# Altium project COMRAD_0v1.PrjPCB (part 1 of 5)
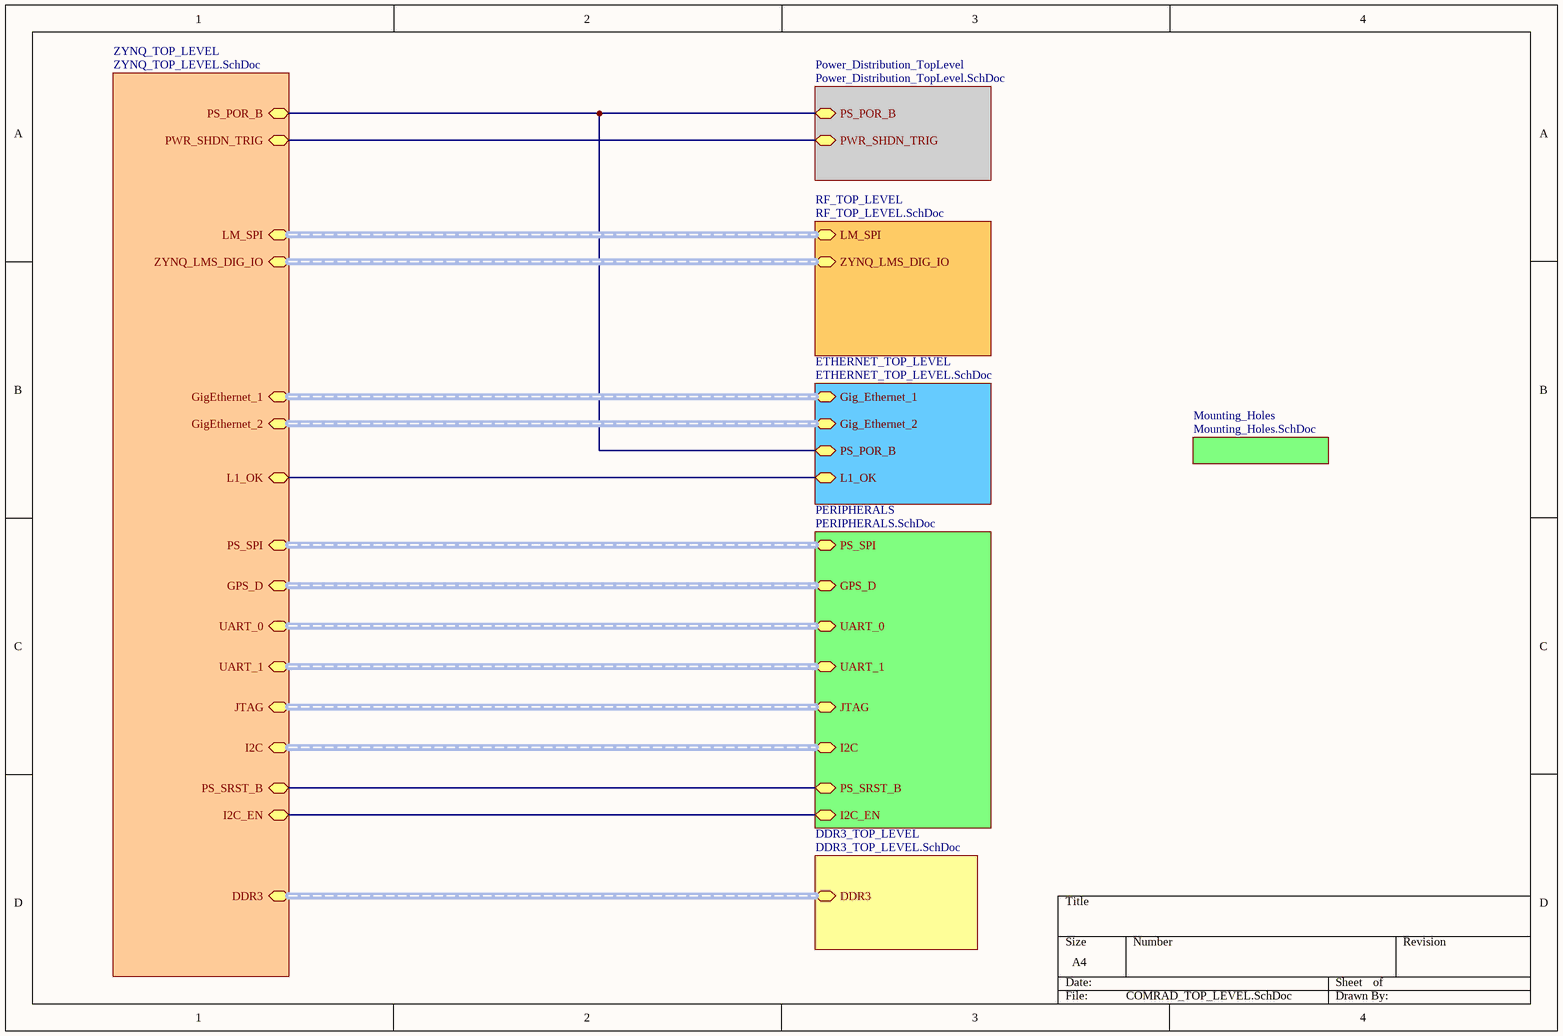
[diagram p0: COMRAD_TOP_LEVEL.SchDoc]
47 sheets, 837 parts. Net scope: hierarchical (ports join the sheet entries above them; power ports are global).
Board file: WhiteRHINO_0v1.PcbDoc
Sheets:
  COMRAD_TOP_LEVEL.SchDoc
    ZYNQ_TOP_LEVEL = ZYNQ_TOP_LEVEL.SchDoc
      ZYNQ_DDR3_Bank_502 = ZYNQ_DDR3_Bank_502.SchDoc
      ZYNQ_MIOBank_500 = ZYNQ_MIOBank_500.SchDoc
      ZYNQ_MIOBank_501 = ZYNQ_MIOBank_501.SchDoc
      ZYNQ_PL_Bank_13 = ZYNQ_PL_Bank_13.SchDoc
      ZYNQ_PL_Bank_33 = ZYNQ_PL_Bank_33.SchDoc
      ZYNQ_PL_Bank_34 = ZYNQ_PL_Bank_34.SchDoc
      ZYNQ_PL_Bank_35 = ZYNQ_PL_Bank_35.SchDoc
      ZYNQ_Power = ZYNQ_Power.SchDoc
      ZYNQ_CONFIG = ZYNQ_CONFIG.SchDoc
    ETHERNET_TOP_LEVEL = ETHERNET_TOP_LEVEL.SchDoc
      Ethernet1 = Ethernet1.SchDoc
      Ethernet1_MDIO = Ethernet1_MDIO.SchDoc
      Ethernet1_Power = Ethernet1_Power.SchDoc
      Ethernet2 = Ethernet2.SchDoc
      Ethernet2_MDIO = Ethernet2_MDIO.SchDoc
      Ethernet2_Power = Ethernet2_Power.SchDoc
    PERIPHERALS = PERIPHERALS.SchDoc
      BootFlash_SPI = BootFlash_SPI.SchDoc
      GPS_Receiver = GPS_Receiver.SchDoc
      USBJTAG_USBUART_4-Channel = USBJTAG_USBUART_4-Channel.SchDoc
      Temperature_Sensors = Temperature_Sensors.SchDoc
    RF_TOP_LEVEL = RF_TOP_LEVEL.SchDoc
      RF_Receive = RF_Receive.SchDoc
      RF_Transmit = RF_Transmit.SchDoc
      RF_Transceiver_LMS6003D_TopLevel = RF_Transceiver_LMS6003D_TopLevel.SchDoc
        RF_Transceiver_LM6002D = RF_Transceiver_LM6002D.SchDoc
        RF_Transceiver_LM6002D_Power = RF_Transceiver_LM6002D_Power.SchDoc
        RF_Transceiver_LMS6002_PLL_CLK = RF_Transceiver_LMS6002_PLL_CLK.SchDoc
    Power_Distribution_TopLevel = Power_Distribution_TopLevel.SchDoc
      PowerSwitch = PowerSwitch.SchDoc
      Power_Regulators_Digital_1 = Power_Regulators_Digital_1.SchDoc
      Power_Regulators_Digital_2 = Power_Regulators_Digital_2.SchDoc
      Power_Regulators_Digital_3 = Power_Regulators_Digital_3.SchDoc
      Power_Regulators_Digital_4 = Power_Regulators_Digital_4.SchDoc
      Power_Regulators_Digital_5 = Power_Regulators_Digital_5.SchDoc
      Power_Regulators_Ether2V5 = Power_Regulators_Ether2V5.SchDoc
      Power_Regulators_RF_2 = Power_Regulators_RF_2.SchDoc
      Power_Regulators_RF_3 = Power_Regulators_RF_3.SchDoc
      Power_Regulators_RF_4 = Power_Regulators_RF_4.SchDoc
      Shundown_Mechanism = Shundown_Mechanism.SchDoc
    DDR3_TOP_LEVEL = DDR3_TOP_LEVEL.SchDoc
      DDR3_1 = DDR3_1.SchDoc
      DDR3_2 = DDR3_2.SchDoc
      DDR3_Power_Termination = DDR3_Power_Termination.SchDoc
    Mounting_Holes = Mounting_Holes.SchDoc

## Sheet COMRAD_TOP_LEVEL.SchDoc
size A4; DocumentNumber: 1; SheetNumber: 1; SheetTotal: 47

### Sub-sheets
DDR3_TOP_LEVEL = DDR3_TOP_LEVEL.SchDoc: DDR3 (harness DDR3)
ETHERNET_TOP_LEVEL = ETHERNET_TOP_LEVEL.SchDoc: Gig_Ethernet_1 (harness Gig_Ethernet1), Gig_Ethernet_2 (harness Gig_Ethernet2), PS_POR_B (bidir), L1_OK
Mounting_Holes = Mounting_Holes.SchDoc: no entries
PERIPHERALS = PERIPHERALS.SchDoc: PS_SPI (harness SPI), GPS_D (harness GPS), UART_0 (harness UART_0), JTAG (harness JTAG), UART_1 (harness UART_1), I2C (harness I2C), PS_SRST_B (bidir), I2C_EN (bidir)
Power_Distribution_TopLevel = Power_Distribution_TopLevel.SchDoc: PS_POR_B (bidir), PWR_SHDN_TRIG (bidir)
RF_TOP_LEVEL = RF_TOP_LEVEL.SchDoc: LM_SPI (harness LM_SPI), ZYNQ_LMS_DIG_IO (harness DIG_IO)
ZYNQ_TOP_LEVEL = ZYNQ_TOP_LEVEL.SchDoc: DDR3 (harness DDR3), PS_SPI (harness SPI), UART_0 (harness UART_0), GigEthernet_1 (harness Gig_Ethernet1), GigEthernet_2 (harness Gig_Ethernet2), JTAG (harness JTAG), ZYNQ_LMS_DIG_IO (harness DIG_IO), LM_SPI (harness LM_SPI), GPS_D (harness GPS), PS_POR_B (bidir), UART_1 (harness UART_1), I2C (harness I2C), PS_SRST_B (bidir), PWR_SHDN_TRIG (bidir), I2C_EN (bidir), L1_OK

### Nets
I2C_EN: sheet ZYNQ_TOP_LEVEL/I2C_EN, sheet PERIPHERALS/I2C_EN
PS_POR_B: sheet ZYNQ_TOP_LEVEL/PS_POR_B, sheet ETHERNET_TOP_LEVEL/PS_POR_B, sheet Power_Distribution_TopLevel/PS_POR_B
PS_SRST_B: sheet ZYNQ_TOP_LEVEL/PS_SRST_B, sheet PERIPHERALS/PS_SRST_B
NetJ11_2: sheet ZYNQ_TOP_LEVEL/L1_OK, sheet ETHERNET_TOP_LEVEL/L1_OK
NetR316_2: sheet ZYNQ_TOP_LEVEL/PWR_SHDN_TRIG, sheet Power_Distribution_TopLevel/PWR_SHDN_TRIG

### Buses and harness runs
harness sheet DDR3_TOP_LEVEL/DDR3 = sheet ZYNQ_TOP_LEVEL/DDR3
harness sheet ETHERNET_TOP_LEVEL/Gig_Ethernet_1 = sheet ZYNQ_TOP_LEVEL/GigEthernet_1
harness sheet ETHERNET_TOP_LEVEL/Gig_Ethernet_2 = sheet ZYNQ_TOP_LEVEL/GigEthernet_2
harness sheet PERIPHERALS/GPS_D = sheet ZYNQ_TOP_LEVEL/GPS_D
harness sheet PERIPHERALS/I2C = sheet ZYNQ_TOP_LEVEL/I2C
harness sheet PERIPHERALS/JTAG = sheet ZYNQ_TOP_LEVEL/JTAG
harness sheet PERIPHERALS/PS_SPI = sheet ZYNQ_TOP_LEVEL/PS_SPI
harness sheet PERIPHERALS/UART_0 = sheet ZYNQ_TOP_LEVEL/UART_0
harness sheet PERIPHERALS/UART_1 = sheet ZYNQ_TOP_LEVEL/UART_1
harness sheet RF_TOP_LEVEL/LM_SPI = sheet ZYNQ_TOP_LEVEL/LM_SPI
harness sheet RF_TOP_LEVEL/ZYNQ_LMS_DIG_IO = sheet ZYNQ_TOP_LEVEL/ZYNQ_LMS_DIG_IO

## Sheet ZYNQ_TOP_LEVEL.SchDoc
size A4; DocumentNumber: 41; SheetNumber: 41; SheetTotal: 47
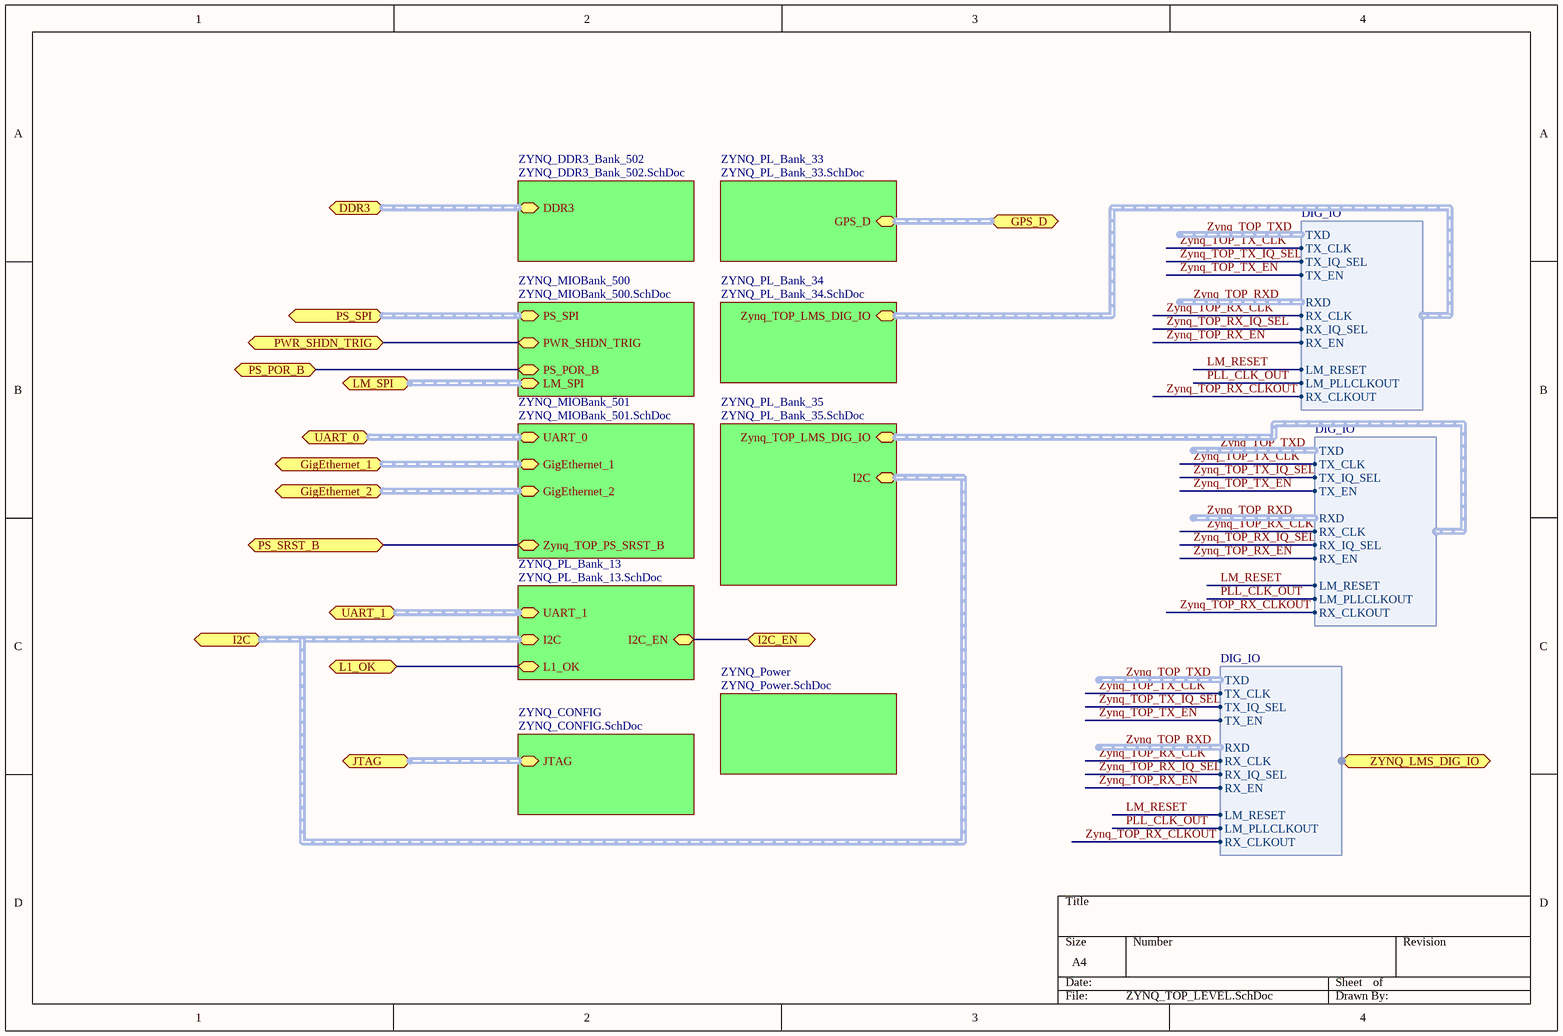
[diagram p1: ZYNQ_TOP_LEVEL.SchDoc]

### Sub-sheets
ZYNQ_CONFIG = ZYNQ_CONFIG.SchDoc: JTAG (harness JTAG)
ZYNQ_DDR3_Bank_502 = ZYNQ_DDR3_Bank_502.SchDoc: DDR3 (harness DDR3)
ZYNQ_MIOBank_500 = ZYNQ_MIOBank_500.SchDoc: PS_SPI (harness SPI), PS_POR_B (bidir), PWR_SHDN_TRIG (bidir), LM_SPI (harness LM_SPI)
ZYNQ_MIOBank_501 = ZYNQ_MIOBank_501.SchDoc: UART_0 (harness UART_0), GigEthernet_1 (harness Gig_Ethernet1), GigEthernet_2 (harness Gig_Ethernet2), Zynq_TOP_PS_SRST_B (bidir)
ZYNQ_PL_Bank_13 = ZYNQ_PL_Bank_13.SchDoc: UART_1 (harness UART_1), I2C (harness I2C), L1_OK, I2C_EN
ZYNQ_PL_Bank_33 = ZYNQ_PL_Bank_33.SchDoc: GPS_D (harness GPS)
ZYNQ_PL_Bank_34 = ZYNQ_PL_Bank_34.SchDoc: Zynq_TOP_LMS_DIG_IO (harness DIG_IO)
ZYNQ_PL_Bank_35 = ZYNQ_PL_Bank_35.SchDoc: Zynq_TOP_LMS_DIG_IO (harness DIG_IO), I2C (harness I2C)
ZYNQ_Power = ZYNQ_Power.SchDoc: no entries

### Ports
DDR3 (harness DDR3), GigEthernet_1 (harness Gig_Ethernet1), GigEthernet_2 (harness Gig_Ethernet2), GPS_D (harness GPS), I2C (harness I2C), I2C_EN (bidir), JTAG (harness JTAG), L1_OK, LM_SPI (harness LM_SPI), PS_POR_B (bidir), PS_SPI (harness SPI), PS_SRST_B (bidir), PWR_SHDN_TRIG (bidir), UART_0 (harness UART_0), UART_1 (harness UART_1), ZYNQ_LMS_DIG_IO (harness DIG_IO)

### Harnesses
DIG_IO: TXD, TX_CLK, TX_IQ_SEL, TX_EN, RXD, RX_CLK, RX_IQ_SEL, RX_EN, LM_RESET, LM_PLLCLKOUT, RX_CLKOUT

### Nets
I2C_EN: port I2C_EN, sheet ZYNQ_PL_Bank_13/I2C_EN
LM_RESET: sheet ZYNQ_PL_Bank_34/Zynq_TOP_LMS_DIG_IO.LM_RESET, sheet ZYNQ_PL_Bank_35/Zynq_TOP_LMS_DIG_IO.LM_RESET, port ZYNQ_LMS_DIG_IO.LM_RESET
PLL_CLK_OUT: sheet ZYNQ_PL_Bank_34/Zynq_TOP_LMS_DIG_IO.LM_PLLCLKOUT, sheet ZYNQ_PL_Bank_35/Zynq_TOP_LMS_DIG_IO.LM_PLLCLKOUT, port ZYNQ_LMS_DIG_IO.LM_PLLCLKOUT
PS_POR_B: port PS_POR_B, sheet ZYNQ_MIOBank_500/PS_POR_B
PS_SRST_B: port PS_SRST_B, sheet ZYNQ_MIOBank_501/Zynq_TOP_PS_SRST_B
Zynq_TOP_RX_CLK: sheet ZYNQ_PL_Bank_34/Zynq_TOP_LMS_DIG_IO.RX_CLK, sheet ZYNQ_PL_Bank_35/Zynq_TOP_LMS_DIG_IO.RX_CLK, port ZYNQ_LMS_DIG_IO.RX_CLK  [project net RX_CLK]
Zynq_TOP_RX_CLKOUT: sheet ZYNQ_PL_Bank_34/Zynq_TOP_LMS_DIG_IO.RX_CLKOUT, sheet ZYNQ_PL_Bank_35/Zynq_TOP_LMS_DIG_IO.RX_CLKOUT, port ZYNQ_LMS_DIG_IO.RX_CLKOUT  [project net RX_CLKOUT]
Zynq_TOP_RX_EN: sheet ZYNQ_PL_Bank_34/Zynq_TOP_LMS_DIG_IO.RX_EN, sheet ZYNQ_PL_Bank_35/Zynq_TOP_LMS_DIG_IO.RX_EN, port ZYNQ_LMS_DIG_IO.RX_EN  [project net RX_EN]
Zynq_TOP_RX_IQ_SEL: sheet ZYNQ_PL_Bank_34/Zynq_TOP_LMS_DIG_IO.RX_IQ_SEL, sheet ZYNQ_PL_Bank_35/Zynq_TOP_LMS_DIG_IO.RX_IQ_SEL, port ZYNQ_LMS_DIG_IO.RX_IQ_SEL  [project net RX_IQ_SEL]
Zynq_TOP_TX_CLK: sheet ZYNQ_PL_Bank_34/Zynq_TOP_LMS_DIG_IO.TX_CLK, sheet ZYNQ_PL_Bank_35/Zynq_TOP_LMS_DIG_IO.TX_CLK, port ZYNQ_LMS_DIG_IO.TX_CLK  [project net TX_CLK]
Zynq_TOP_TX_EN: sheet ZYNQ_PL_Bank_34/Zynq_TOP_LMS_DIG_IO.TX_EN, sheet ZYNQ_PL_Bank_35/Zynq_TOP_LMS_DIG_IO.TX_EN, port ZYNQ_LMS_DIG_IO.TX_EN  [project net TX_EN]
Zynq_TOP_TX_IQ_SEL: sheet ZYNQ_PL_Bank_34/Zynq_TOP_LMS_DIG_IO.TX_IQ_SEL, sheet ZYNQ_PL_Bank_35/Zynq_TOP_LMS_DIG_IO.TX_IQ_SEL, port ZYNQ_LMS_DIG_IO.TX_IQ_SEL  [project net TX_IQ_SEL]
NetJ11_2: port L1_OK, sheet ZYNQ_PL_Bank_13/L1_OK
NetR316_2: port PWR_SHDN_TRIG, sheet ZYNQ_MIOBank_500/PWR_SHDN_TRIG

### Buses and harness runs
harness port DDR3 = sheet ZYNQ_DDR3_Bank_502/DDR3
harness port GigEthernet_1 = sheet ZYNQ_MIOBank_501/GigEthernet_1
harness port GigEthernet_2 = sheet ZYNQ_MIOBank_501/GigEthernet_2
harness port GPS_D = sheet ZYNQ_PL_Bank_33/GPS_D
harness port I2C = sheet ZYNQ_PL_Bank_13/I2C = sheet ZYNQ_PL_Bank_35/I2C
harness port JTAG = sheet ZYNQ_CONFIG/JTAG
harness port LM_SPI = sheet ZYNQ_MIOBank_500/LM_SPI
harness port PS_SPI = sheet ZYNQ_MIOBank_500/PS_SPI
harness port UART_0 = sheet ZYNQ_MIOBank_501/UART_0
harness port UART_1 = sheet ZYNQ_PL_Bank_13/UART_1

## Sheet ZYNQ_DDR3_Bank_502.SchDoc
size A4; DocumentNumber: 10; SheetNumber: 10; SheetTotal: 47
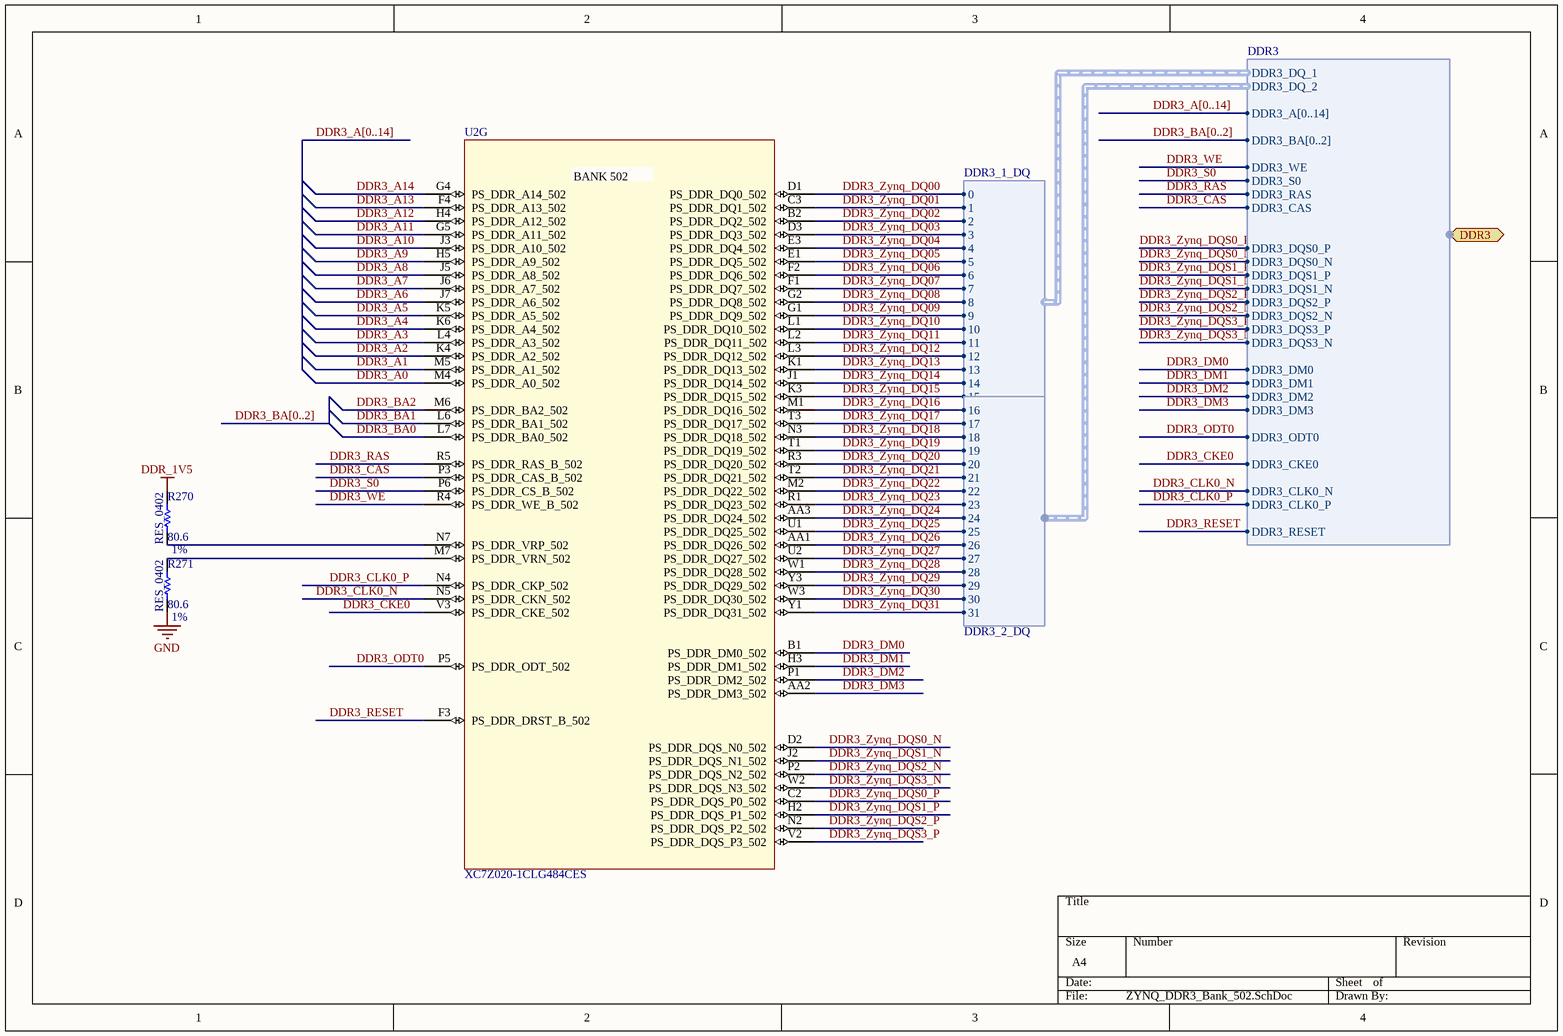
[diagram p2: ZYNQ_DDR3_Bank_502.SchDoc]

### Parts
R270  RES_0402  value 80.6  Tolerance: 1%  [RESC0402(1005)_N]
R271  RES_0402  value 80.6  Tolerance: 1%  [RESC0402(1005)_N]
U2  XC7Z020-1CLG484CES  [ZYNQ_xc7z020clg484pkg_BGA-484]  (part G of 10)

### Ports
DDR3 (harness DDR3)

### Harnesses
DDR3: DDR3_DQ_1, DDR3_DQ_2, DDR3_A[0..14], DDR3_BA[0..2], DDR3_WE, DDR3_S0, DDR3_RAS, DDR3_CAS, DDR3_DQS0_P, DDR3_DQS0_N, DDR3_DQS1_P, DDR3_DQS1_N, DDR3_DQS2_P, DDR3_DQS2_N, DDR3_DQS3_P, DDR3_DQS3_N, DDR3_DM0, DDR3_DM1, DDR3_DM2, DDR3_DM3, DDR3_ODT0, DDR3_CKE0, DDR3_CLK0_N, DDR3_CLK0_P, DDR3_RESET
DDR3_1_DQ: 0, 1, 2, 3, 4, 5, 6, 7, 8, 9, 10, 11, 12, 13, 14, 15
DDR3_2_DQ: 16, 17, 18, 19, 20, 21, 22, 23, 24, 25, 26, 27, 28, 29, 30, 31

### Nets
DDR_1V5: R270.2
GND: R271.1
DDR3_A0: U2.M4(PS_DDR_A0_502)
DDR3_A1: U2.M5(PS_DDR_A1_502)
DDR3_A2: U2.K4(PS_DDR_A2_502)
DDR3_A3: U2.L4(PS_DDR_A3_502)
DDR3_A4: U2.K6(PS_DDR_A4_502)
DDR3_A5: U2.K5(PS_DDR_A5_502)
DDR3_A6: U2.J7(PS_DDR_A6_502)
DDR3_A7: U2.J6(PS_DDR_A7_502)
DDR3_A8: U2.J5(PS_DDR_A8_502)
DDR3_A9: U2.H5(PS_DDR_A9_502)
DDR3_A10: U2.J3(PS_DDR_A10_502)
DDR3_A11: U2.G5(PS_DDR_A11_502)
DDR3_A12: U2.H4(PS_DDR_A12_502)
DDR3_A13: U2.F4(PS_DDR_A13_502)
DDR3_A14: U2.G4(PS_DDR_A14_502)
DDR3_BA0: U2.L7(PS_DDR_BA0_502)
DDR3_BA1: U2.L6(PS_DDR_BA1_502)
DDR3_BA2: U2.M6(PS_DDR_BA2_502)
DDR3_CAS: U2.P3(PS_DDR_CAS_B_502) ; port DDR3.DDR3_CAS
DDR3_CKE0: U2.V3(PS_DDR_CKE_502) ; port DDR3.DDR3_CKE0
DDR3_CLK0_N: U2.N5(PS_DDR_CKN_502) ; port DDR3.DDR3_CLK0_N
DDR3_CLK0_P: U2.N4(PS_DDR_CKP_502) ; port DDR3.DDR3_CLK0_P
DDR3_DM0: U2.B1(PS_DDR_DM0_502) ; port DDR3.DDR3_DM0
DDR3_DM1: U2.H3(PS_DDR_DM1_502) ; port DDR3.DDR3_DM1
DDR3_DM2: U2.P1(PS_DDR_DM2_502) ; port DDR3.DDR3_DM2
DDR3_DM3: U2.AA2(PS_DDR_DM3_502) ; port DDR3.DDR3_DM3
DDR3_ODT0: U2.P5(PS_DDR_ODT_502) ; port DDR3.DDR3_ODT0
DDR3_RAS: U2.R5(PS_DDR_RAS_B_502) ; port DDR3.DDR3_RAS
DDR3_RESET: U2.F3(PS_DDR_DRST_B_502) ; port DDR3.DDR3_RESET
DDR3_S0: U2.P6(PS_DDR_CS_B_502) ; port DDR3.DDR3_S0
DDR3_WE: U2.R4(PS_DDR_WE_B_502) ; port DDR3.DDR3_WE
DDR3_Zynq_DQ00: U2.D1(PS_DDR_DQ0_502) ; harness DDR3_1_DQ.0  [project net DDR3_DQ00]
DDR3_Zynq_DQ01: U2.C3(PS_DDR_DQ1_502) ; harness DDR3_1_DQ.1  [project net DDR3_DQ01]
DDR3_Zynq_DQ02: U2.B2(PS_DDR_DQ2_502) ; harness DDR3_1_DQ.2  [project net DDR3_DQ02]
DDR3_Zynq_DQ03: U2.D3(PS_DDR_DQ3_502) ; harness DDR3_1_DQ.3  [project net DDR3_DQ03]
DDR3_Zynq_DQ04: U2.E3(PS_DDR_DQ4_502) ; harness DDR3_1_DQ.4  [project net DDR3_DQ04]
DDR3_Zynq_DQ05: U2.E1(PS_DDR_DQ5_502) ; harness DDR3_1_DQ.5  [project net DDR3_DQ05]
DDR3_Zynq_DQ06: U2.F2(PS_DDR_DQ6_502) ; harness DDR3_1_DQ.6  [project net DDR3_DQ06]
DDR3_Zynq_DQ07: U2.F1(PS_DDR_DQ7_502) ; harness DDR3_1_DQ.7  [project net DDR3_DQ07]
DDR3_Zynq_DQ08: U2.G2(PS_DDR_DQ8_502) ; harness DDR3_1_DQ.8  [project net DDR3_DQ08]
DDR3_Zynq_DQ09: U2.G1(PS_DDR_DQ9_502) ; harness DDR3_1_DQ.9  [project net DDR3_DQ09]
DDR3_Zynq_DQ10: U2.L1(PS_DDR_DQ10_502) ; harness DDR3_1_DQ.10  [project net DDR3_DQ10]
DDR3_Zynq_DQ11: U2.L2(PS_DDR_DQ11_502) ; harness DDR3_1_DQ.11  [project net DDR3_DQ11]
DDR3_Zynq_DQ12: U2.L3(PS_DDR_DQ12_502) ; harness DDR3_1_DQ.12  [project net DDR3_DQ12]
DDR3_Zynq_DQ13: U2.K1(PS_DDR_DQ13_502) ; harness DDR3_1_DQ.13  [project net DDR3_DQ13]
DDR3_Zynq_DQ14: U2.J1(PS_DDR_DQ14_502) ; harness DDR3_1_DQ.14  [project net DDR3_DQ14]
DDR3_Zynq_DQ15: U2.K3(PS_DDR_DQ15_502) ; harness DDR3_1_DQ.15  [project net DDR3_DQ15]
DDR3_Zynq_DQ16: U2.M1(PS_DDR_DQ16_502) ; harness DDR3_2_DQ.16  [project net DDR3_DQ16]
DDR3_Zynq_DQ17: U2.T3(PS_DDR_DQ17_502) ; harness DDR3_2_DQ.17  [project net DDR3_DQ17]
DDR3_Zynq_DQ18: U2.N3(PS_DDR_DQ18_502) ; harness DDR3_2_DQ.18  [project net DDR3_DQ18]
DDR3_Zynq_DQ19: U2.T1(PS_DDR_DQ19_502) ; harness DDR3_2_DQ.19  [project net DDR3_DQ19]
DDR3_Zynq_DQ20: U2.R3(PS_DDR_DQ20_502) ; harness DDR3_2_DQ.20  [project net DDR3_DQ20]
DDR3_Zynq_DQ21: U2.T2(PS_DDR_DQ21_502) ; harness DDR3_2_DQ.21  [project net DDR3_DQ21]
DDR3_Zynq_DQ22: U2.M2(PS_DDR_DQ22_502) ; harness DDR3_2_DQ.22  [project net DDR3_DQ22]
DDR3_Zynq_DQ23: U2.R1(PS_DDR_DQ23_502) ; harness DDR3_2_DQ.23  [project net DDR3_DQ23]
DDR3_Zynq_DQ24: U2.AA3(PS_DDR_DQ24_502) ; harness DDR3_2_DQ.24  [project net DDR3_DQ24]
DDR3_Zynq_DQ25: U2.U1(PS_DDR_DQ25_502) ; harness DDR3_2_DQ.25  [project net DDR3_DQ25]
DDR3_Zynq_DQ26: U2.AA1(PS_DDR_DQ26_502) ; harness DDR3_2_DQ.26  [project net DDR3_DQ26]
DDR3_Zynq_DQ27: U2.U2(PS_DDR_DQ27_502) ; harness DDR3_2_DQ.27  [project net DDR3_DQ27]
DDR3_Zynq_DQ28: U2.W1(PS_DDR_DQ28_502) ; harness DDR3_2_DQ.28  [project net DDR3_DQ28]
DDR3_Zynq_DQ29: U2.Y3(PS_DDR_DQ29_502) ; harness DDR3_2_DQ.29  [project net DDR3_DQ29]
DDR3_Zynq_DQ30: U2.W3(PS_DDR_DQ30_502) ; harness DDR3_2_DQ.30  [project net DDR3_DQ30]
DDR3_Zynq_DQ31: U2.Y1(PS_DDR_DQ31_502) ; harness DDR3_2_DQ.31  [project net DDR3_DQ31]
DDR3_Zynq_DQS0_N: U2.D2(PS_DDR_DQS_N0_502) ; port DDR3.DDR3_DQS0_N  [project net DDR3_DQS0_N]
DDR3_Zynq_DQS0_P: U2.C2(PS_DDR_DQS_P0_502) ; port DDR3.DDR3_DQS0_P  [project net DDR3_DQS0_P]
DDR3_Zynq_DQS1_N: U2.J2(PS_DDR_DQS_N1_502) ; port DDR3.DDR3_DQS1_N  [project net DDR3_DQS1_N]
DDR3_Zynq_DQS1_P: U2.H2(PS_DDR_DQS_P1_502) ; port DDR3.DDR3_DQS1_P  [project net DDR3_DQS1_P]
DDR3_Zynq_DQS2_N: U2.P2(PS_DDR_DQS_N2_502) ; port DDR3.DDR3_DQS2_N  [project net DDR3_DQS2_N]
DDR3_Zynq_DQS2_P: U2.N2(PS_DDR_DQS_P2_502) ; port DDR3.DDR3_DQS2_P  [project net DDR3_DQS2_P]
DDR3_Zynq_DQS3_N: U2.W2(PS_DDR_DQS_N3_502) ; port DDR3.DDR3_DQS3_N  [project net DDR3_DQS3_N]
DDR3_Zynq_DQS3_P: U2.V2(PS_DDR_DQS_P3_502) ; port DDR3.DDR3_DQS3_P  [project net DDR3_DQS3_P]
NetR270_1: R270.1 U2.N7(PS_DDR_VRP_502)
NetR271_2: R271.2 U2.M7(PS_DDR_VRN_502)

### Buses and harness runs
bus DDR3_A[0..14]
bus DDR3_BA[0..2]

### Notes on the sheet
- (in symbol XC7Z020-1CLG484CES, part G) BANK 502

### Library data of the parts
R270 R271 = RMCF0402FT80R6: 80.6 ohm, 1% 1/16W, 0402; Manufacturer: Stackpole Electronics; Part Number: RMCF0402FT80R6; Footprint Ref: RESC0402(1005)_N; Library Ref: RES_0402
U2 = XC7Z020-1CLG484CES: XC7Z020-1CLG484CES, Zynq-7000 All Programmable SoC; Manufacturer: Xilinx; Part Number: XC7Z020-1CLG484CES

## Sheet ZYNQ_MIOBank_500.SchDoc
size A4; DocumentNumber: 8; SheetNumber: 8; SheetTotal: 47
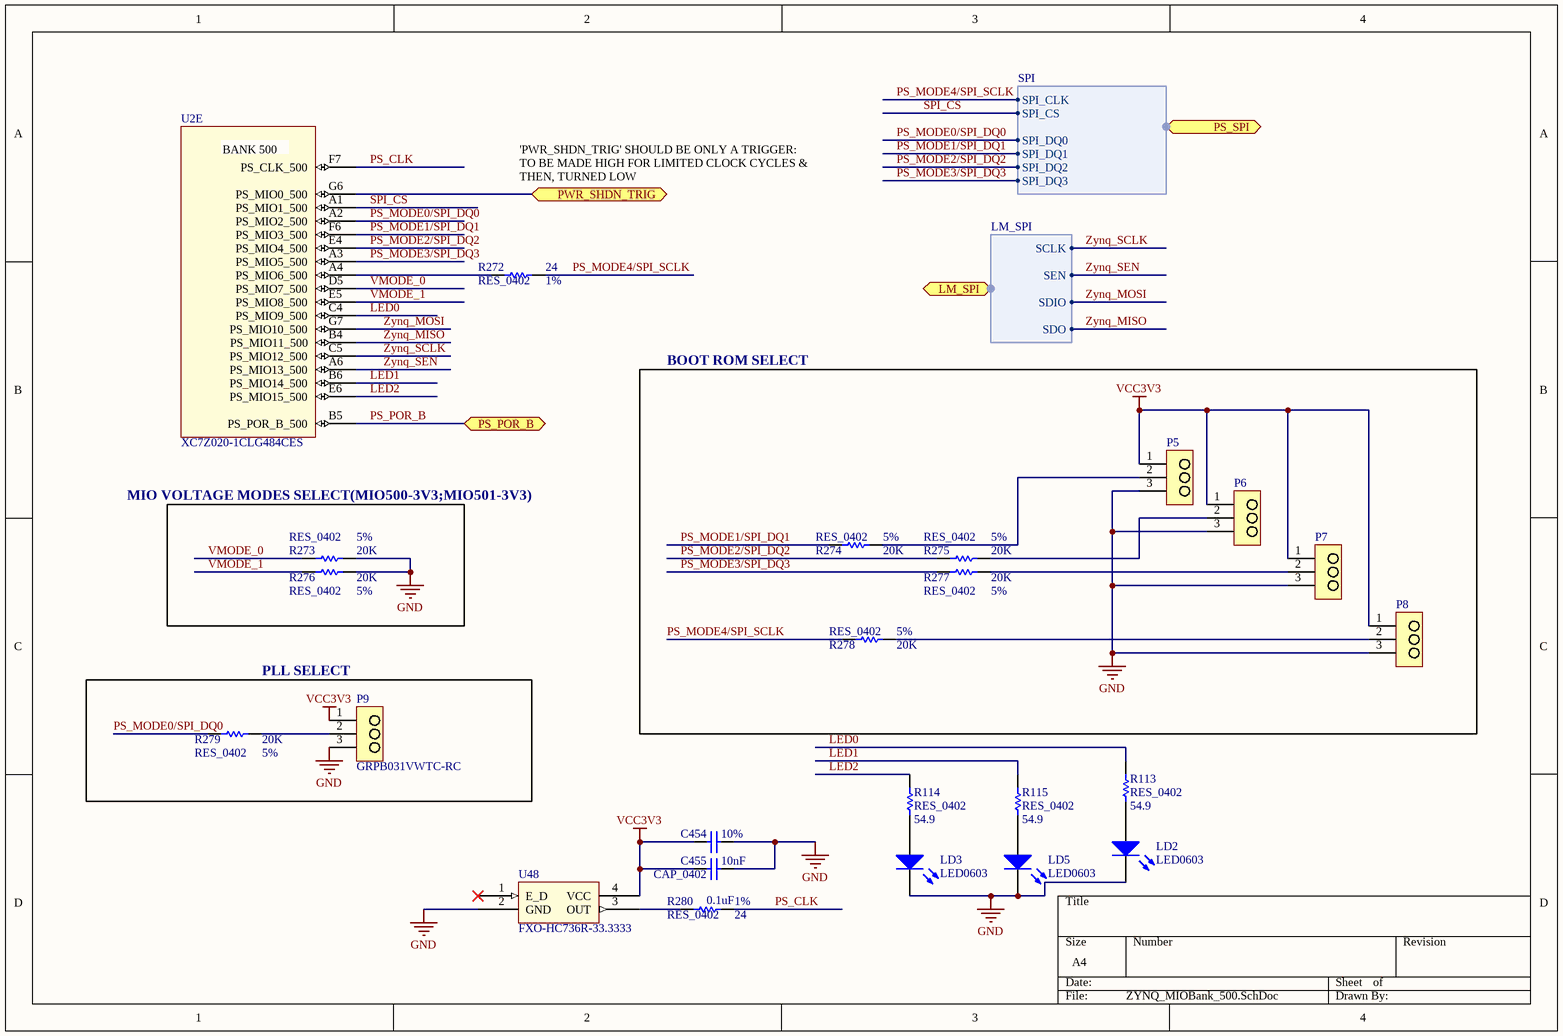
[diagram p3: ZYNQ_MIOBank_500.SchDoc]

### Parts
C454  CAP_0402  value 10nF  Tolerance: 10%  [CAPC0402(1005)60_N]
C455  value 0.1uF  [CAPC0402(1005)60_N]  (hidden comment: TMK105BJ104KV-F)
LD2  LED0603  [LED0603(1608)_HSMG-C190]
LD3  LED0603  [LED0603(1608)_HSMG-C190]
LD5  LED0603  [LED0603(1608)_HSMG-C190]
P5  GRPB031VWTC-RC  [Header_3-Pos_Sullins_GRPB031VWTC-RC]  (value not drawn)
P6  GRPB031VWTC-RC  [Header_3-Pos_Sullins_GRPB031VWTC-RC]  (value not drawn)
P7  GRPB031VWTC-RC  [Header_3-Pos_Sullins_GRPB031VWTC-RC]  (value not drawn)
P8  GRPB031VWTC-RC  [Header_3-Pos_Sullins_GRPB031VWTC-RC]  (value not drawn)
P9  GRPB031VWTC-RC  [Header_3-Pos_Sullins_GRPB031VWTC-RC]
R113  RES_0402  value 54.9  [RESC0402(1005)_N]
R114  RES_0402  value 54.9  [RESC0402(1005)_N]
R115  RES_0402  value 54.9  [RESC0402(1005)_N]
R272  RES_0402  value 24  Tolerance: 1%  [RESC0402(1005)_N]
R273  RES_0402  value 20K  Tolerance: 5%  [RESC0402(1005)_N]
R274  RES_0402  value 20K  Tolerance: 5%  [RESC0402(1005)_N]
R275  RES_0402  value 20K  Tolerance: 5%  [RESC0402(1005)_N]
R276  RES_0402  value 20K  Tolerance: 5%  [RESC0402(1005)_N]
R277  RES_0402  value 20K  Tolerance: 5%  [RESC0402(1005)_N]
R278  RES_0402  value 20K  Tolerance: 5%  [RESC0402(1005)_N]
R279  RES_0402  value 20K  Tolerance: 5%  [RESC0402(1005)_N]
R280  RES_0402  value 24  Tolerance: 1%  [RESC0402(1005)_N]
U2  XC7Z020-1CLG484CES  [ZYNQ_xc7z020clg484pkg_BGA-484]  (part E of 10)
U48  FXO-HC736R-33.3333  [Oscillator_Fox_FXO-HC736R-33.3333_SMD]

### Blocks framed on the sheet
BOOT ROM SELECT: P5-P8 R274 R275 R277 R278
PLL SELECT: P9 R279

### Ports
LM_SPI (harness LM_SPI), PS_POR_B (bidir), PS_SPI (harness SPI), PWR_SHDN_TRIG (bidir)

### Harnesses
SPI: SPI_CLK, SPI_CS, SPI_DQ0, SPI_DQ1, SPI_DQ2, SPI_DQ3
LM_SPI: SCLK, SEN, SDIO, SDO

### Nets
GND: C454.1 C455.1 LD2.1(K) LD3.1(K) LD5.1(K) P5.3 P6.3 P7.3 P8.3 P9.3 R273.2 R276.2 U48.2(GND)
VCC3V3: C454.2 C455.2 P5.1 P6.1 P7.1 P8.1 P9.1 U48.4(VCC)
LED0: R113.2 U2.C4(PS_MIO9_500)
LED1: R115.2 U2.B6(PS_MIO14_500)
LED2: R114.2 U2.E6(PS_MIO15_500)
PS_CLK: R280.2 U2.F7(PS_CLK_500)
PS_MODE0/SPI_DQ0: R279.1 U2.A2(PS_MIO2_500) ; port PS_SPI.SPI_DQ0
PS_MODE1/SPI_DQ1: R274.1 U2.F6(PS_MIO3_500) ; port PS_SPI.SPI_DQ1
PS_MODE2/SPI_DQ2: R275.1 U2.E4(PS_MIO4_500) ; port PS_SPI.SPI_DQ2
PS_MODE3/SPI_DQ3: R277.1 U2.A3(PS_MIO5_500) ; port PS_SPI.SPI_DQ3
PS_MODE4/SPI_SCLK: R272.2 R278.1 ; port PS_SPI.SPI_CLK
PS_POR_B: U2.B5(PS_POR_B_500) ; port PS_POR_B
SPI_CS: U2.A1(PS_MIO1_500) ; port PS_SPI.SPI_CS
VMODE_0: R273.1 U2.D5(PS_MIO7_500)
VMODE_1: R276.1 U2.E5(PS_MIO8_500)
Zynq_MISO: U2.B4(PS_MIO11_500) ; port LM_SPI.SDO  [project net SDO]
Zynq_MOSI: U2.G7(PS_MIO10_500) ; port LM_SPI.SDIO  [project net SDIO]
Zynq_SCLK: U2.C5(PS_MIO12_500) ; port LM_SPI.SCLK  [project net SCLK]
Zynq_SEN: U2.A6(PS_MIO13_500) ; port LM_SPI.SEN  [project net SEN]
NetLD2_2: LD2.2(A) R113.1
NetLD3_2: LD3.2(A) R114.1
NetLD5_2: LD5.2(A) R115.1
NetP5_2: P5.2 R274.2
NetP6_2: P6.2 R275.2
NetP7_2: P7.2 R277.2
NetP8_2: P8.2 R278.2
NetP9_2: P9.2 R279.2
NetR272_1: R272.1 U2.A4(PS_MIO6_500)
NetR280_1: R280.1 U48.3(OUT)
NetR316_2: U2.G6(PS_MIO0_500) ; port PWR_SHDN_TRIG

Not connected (* = marked no-connect by the designer): U48 1(E_D)*

### Notes on the sheet
- 'PWR_SHDN_TRIG' SHOULD BE ONLY A TRIGGER:
  TO BE MADE HIGH FOR LIMITED CLOCK CYCLES & THEN, TURNED LOW
- MIO VOLTAGE MODES SELECT(MIO500-3V3;MIO501-3V3)
- (in symbol XC7Z020-1CLG484CES, part E) BANK 500

### Library data of the parts
C454 = CAP_0402: 10000pF, ceramic, 10% 6.3V X5R, 0402; Part Number: GRM155R60J103KA01D; Manufacturer: Murata Electronics North America; Footprint Ref: CAPC0402(1005)60_N; Library Ref: CAP_0402
C455 = TMK105BJ104KV-F: 0.1uF, ceramic, 10%, 25V, X5R, 0402; Manufacturer: Taiyo Yuden; Tolerance: 10%; Part Number: TMK105BJ104KV-F
LD2 LD3 LD5 = "HSMG-C190": LED 570NM GREEN DIFF 0603 SMD; Manufacturer: Avago; Value: "HSMG-C190 green"; Part Number: "HSMG-C190"; Footprint Ref: LED0603(1608); Library Ref: LED0603
P5-P9 = GRPB031VWTC-RC: CONN HEADER .050" 3POS SMD GOLD; Manufacturer: Sullins Connector Solutions; Part Number: GRPB031VWTC-RC
R113-R115 = ERJ-2RKF54R9X: RES 54.9 OHM 1/10W 1% 0402 SMD; Manufacturer: Panasonic Electronic Components; Tolerance: *; Part Number: ERJ-2RKF54R9X; Footprint Ref: RESC0402(1005)_N; Library Ref: RES_0402
R272 R280 = CRCW040224R0FKED: 24 ohm, 1% 1/16W, 0402; Manufacturer: Vishay/Dale; Part Number: CRCW040224R0FKED
  R272: Footprint Ref: RESC0402(1005)_N; Library Ref: RES_0402
R273-R279 = RES_0402: 20K ohm, 5%, 1/16W, 0402; Part Number: ERJ-2GEJ203X; Manufacturer: Panasonic - ECG; Library Ref: RES_0402; Footprint Ref: RESC0402(1005)_N
U2 = XC7Z020-1CLG484CES: as U2 on sheet ZYNQ_DDR3_Bank_502; Part Number: XC7Z020-1CLG484CES
U48 = FXO-HC736R-33.3333: OSC 33.3333 MHZ 3.3V HCMOS SMD; Manufacturer: Fox Electronics; Value: 33.333MHz; Part Number: FXO-HC736R-33.3333

## Sheet ZYNQ_MIOBank_501.SchDoc
size A4; DocumentNumber: 9; SheetNumber: 9; SheetTotal: 47
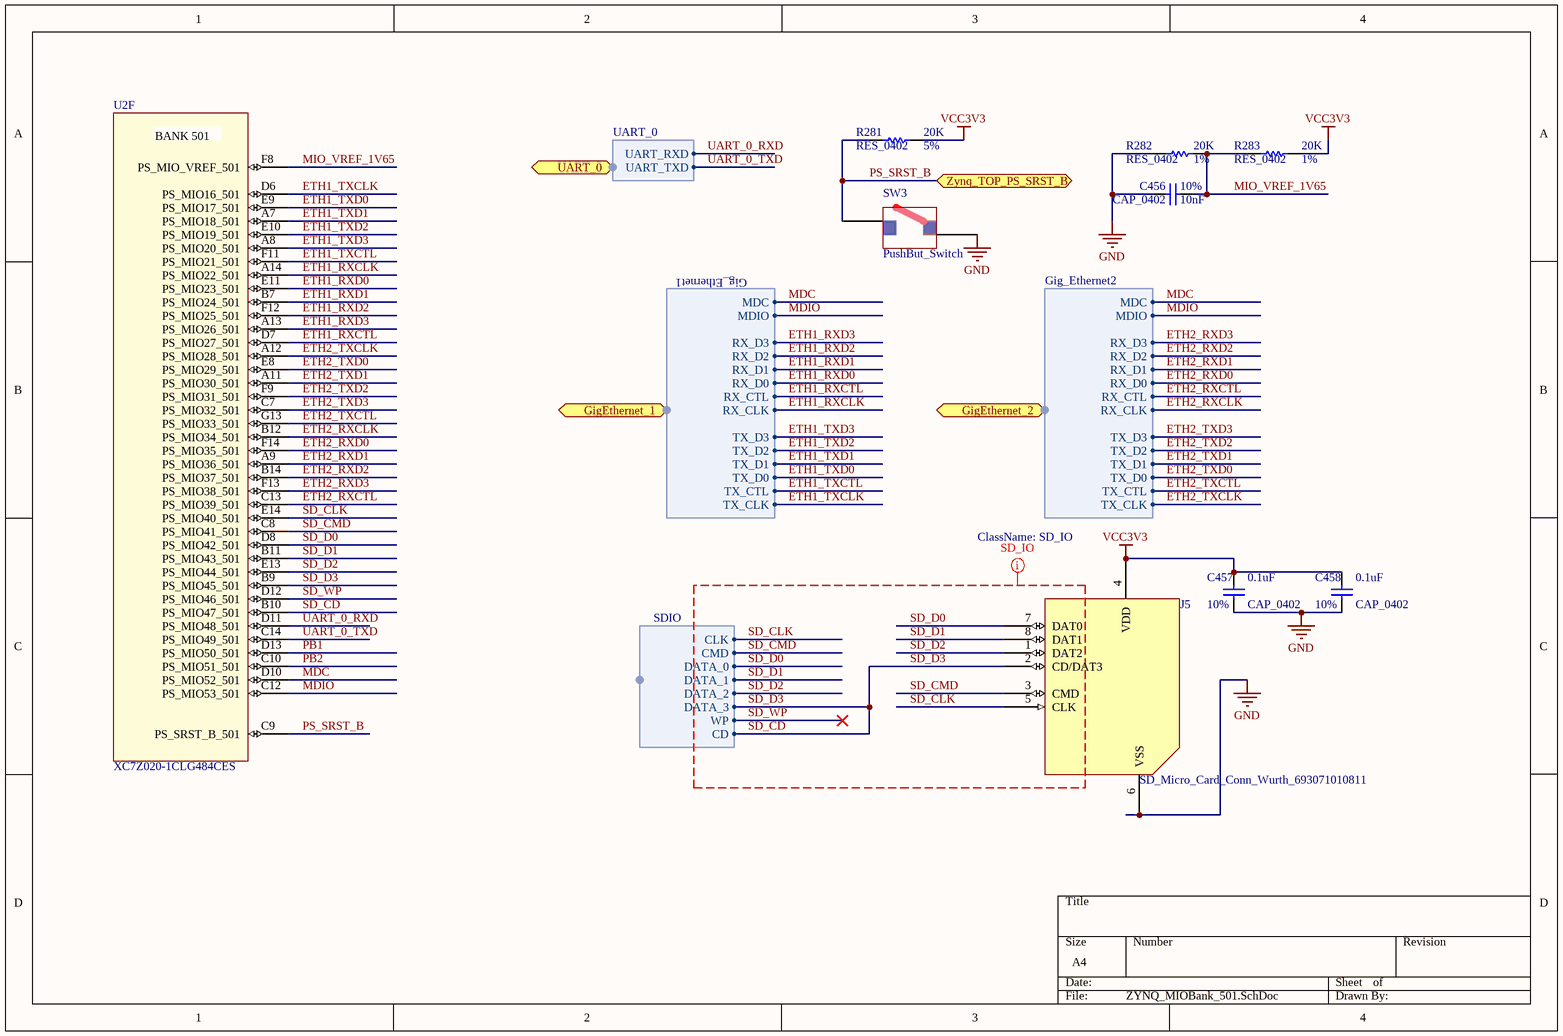
[diagram p4: ZYNQ_MIOBank_501.SchDoc]

### Parts
C456  CAP_0402  value 10nF  Tolerance: 10%  [CAPC0402(1005)60_N]
C457  CAP_0402  value 0.1uF  Tolerance: 10%  [CAPC0402(1005)60_N]
C458  CAP_0402  value 0.1uF  Tolerance: 10%  [CAPC0402(1005)60_N]
J5  SD_Micro_Card_Conn_Wurth_693071010811  [SD_Micro_Card_Conn_Wurth_693071010811]
R281  RES_0402  value 20K  Tolerance: 5%  [RESC0402(1005)_N]
R282  RES_0402  value 20K  Tolerance: 1%  [RESC0402(1005)_N]
R283  RES_0402  value 20K  Tolerance: 1%  [RESC0402(1005)_N]
SW3  PushBut_Switch  [PushButtonSwitch_CnK_1.14002.1110000]
U2  XC7Z020-1CLG484CES  [ZYNQ_xc7z020clg484pkg_BGA-484]  (part F of 10)

### Ports
GigEthernet_1 (harness Gig_Ethernet1), GigEthernet_2 (harness Gig_Ethernet2), UART_0 (harness UART_0), Zynq_TOP_PS_SRST_B (bidir)

### Harnesses
UART_0: UART_TXD, UART_RXD
Gig_Ethernet1: TX_CLK, TX_CTL, TX_D0, TX_D1, TX_D2, TX_D3, RX_D0, RX_D1, RX_D2, RX_D3, RX_CLK, RX_CTL, MDIO, MDC
Gig_Ethernet2: TX_CLK, TX_CTL, TX_D0, TX_D1, TX_D2, TX_D3, RX_D0, RX_D1, RX_D2, RX_D3, RX_CLK, RX_CTL, MDIO, MDC
SDIO: CLK, CMD, DATA_0, DATA_1, DATA_2, DATA_3, WP, CD

### Nets
GND: C456.2 C457.2 C458.2 J5.6(VSS) R282.1 SW3.4
VCC3V3: C457.1 C458.1 J5.4(VDD) R281.2 R283.2
ETH1_RXCLK: U2.A14(PS_MIO22_501) ; port GigEthernet_1.RX_CLK
ETH1_RXCTL: U2.D7(PS_MIO27_501) ; port GigEthernet_1.RX_CTL
ETH1_RXD0: U2.E11(PS_MIO23_501) ; port GigEthernet_1.RX_D0
ETH1_RXD1: U2.B7(PS_MIO24_501) ; port GigEthernet_1.RX_D1
ETH1_RXD2: U2.F12(PS_MIO25_501) ; port GigEthernet_1.RX_D2
ETH1_RXD3: U2.A13(PS_MIO26_501) ; port GigEthernet_1.RX_D3
ETH1_TXCLK: U2.D6(PS_MIO16_501) ; port GigEthernet_1.TX_CLK
ETH1_TXCTL: U2.F11(PS_MIO21_501) ; port GigEthernet_1.TX_CTL
ETH1_TXD0: U2.E9(PS_MIO17_501) ; port GigEthernet_1.TX_D0
ETH1_TXD1: U2.A7(PS_MIO18_501) ; port GigEthernet_1.TX_D1
ETH1_TXD2: U2.E10(PS_MIO19_501) ; port GigEthernet_1.TX_D2
ETH1_TXD3: U2.A8(PS_MIO20_501) ; port GigEthernet_1.TX_D3
ETH2_RXCLK: U2.B12(PS_MIO34_501) ; port GigEthernet_2.RX_CLK
ETH2_RXCTL: U2.C13(PS_MIO39_501) ; port GigEthernet_2.RX_CTL
ETH2_RXD0: U2.F14(PS_MIO35_501) ; port GigEthernet_2.RX_D0
ETH2_RXD1: U2.A9(PS_MIO36_501) ; port GigEthernet_2.RX_D1
ETH2_RXD2: U2.B14(PS_MIO37_501) ; port GigEthernet_2.RX_D2
ETH2_RXD3: U2.F13(PS_MIO38_501) ; port GigEthernet_2.RX_D3
ETH2_TXCLK: U2.A12(PS_MIO28_501) ; port GigEthernet_2.TX_CLK
ETH2_TXCTL: U2.G13(PS_MIO33_501) ; port GigEthernet_2.TX_CTL
ETH2_TXD0: U2.E8(PS_MIO29_501) ; port GigEthernet_2.TX_D0
ETH2_TXD1: U2.A11(PS_MIO30_501) ; port GigEthernet_2.TX_D1
ETH2_TXD2: U2.F9(PS_MIO31_501) ; port GigEthernet_2.TX_D2
ETH2_TXD3: U2.C7(PS_MIO32_501) ; port GigEthernet_2.TX_D3
MDC: U2.D10(PS_MIO52_501) ; port GigEthernet_1.MDC, port GigEthernet_2.MDC
MDIO: U2.C12(PS_MIO53_501) ; port GigEthernet_1.MDIO, port GigEthernet_2.MDIO
MIO_VREF_1V65: C456.1 R282.2 R283.1 U2.F8(PS_MIO_VREF_501)
PB1: U2.D13(PS_MIO50_501)
PB2: U2.C10(PS_MIO51_501)
PS_SRST_B: R281.1 SW3.3 U2.C9(PS_SRST_B_501) ; port Zynq_TOP_PS_SRST_B
SD_CD: J5.2(CD/DAT3) U2.B9(PS_MIO45_501) U2.B10(PS_MIO47_501) ; harness SDIO.DATA_3, harness SDIO.CD  [also labelled SD_D3]
SD_CLK: J5.5(CLK) U2.E14(PS_MIO40_501) ; harness SDIO.CLK
SD_CMD: J5.3(CMD) U2.C8(PS_MIO41_501) ; harness SDIO.CMD
SD_D0: J5.7(DAT0) U2.D8(PS_MIO42_501) ; harness SDIO.DATA_0
SD_D1: J5.8(DAT1) U2.B11(PS_MIO43_501) ; harness SDIO.DATA_1
SD_D2: J5.1(DAT2) U2.E13(PS_MIO44_501) ; harness SDIO.DATA_2
SD_WP: U2.D12(PS_MIO46_501) ; harness SDIO.WP
UART_0_RXD: U2.D11(PS_MIO48_501) ; port UART_0.UART_RXD
UART_0_TXD: U2.C14(PS_MIO49_501) ; port UART_0.UART_TXD

### Layout directives
net class SD_IO: SD_CD, SD_CLK, SD_CMD, SD_D0, SD_D1, SD_D2, SD_D3, SD_WP

### Notes on the sheet
- (in symbol XC7Z020-1CLG484CES, part F) BANK 501

### Library data of the parts
C456 = CAP_0402: as C454 on sheet ZYNQ_MIOBank_500; Footprint Ref: CAPC0402(1005)60_N; Library Ref: CAP_0402
C457 C458 = CAP_0402: 0.1uf, ceramic, 10%, 6.3V, X5R, 0402; Part Number: C1005X5R0J104K; Manufacturer: TDK Corporation; Footprint Ref: CAPC0402(1005)60_N; Library Ref: CAP_0402
J5 = "693071010811": CONN MICRO SD 8 POS SMD; Manufacturer: Wurth Electronics Inc; Part Number: "693071010811"
R281 = RES_0402: as R273 on sheet ZYNQ_MIOBank_500; Library Ref: RES_0402; Footprint Ref: RESC0402(1005)_N
R282 R283 = RES_0402: RES 20.0K OHM 1/10W 1% 0402 SMD; Part Number: ERJ-2RKF2002X; Manufacturer: Panasonic Electronic Components; Library Ref: RES_0402; Footprint Ref: RESC0402(1005)_N
SW3 = 1.14002.1110000: SWITCH PUSH SPST-NO 0.1A 35V; Manufacturer: C&K Components; Part Number: 1.14002.1110000
U2 = XC7Z020-1CLG484CES: as U2 on sheet ZYNQ_DDR3_Bank_502; Part Number: XC7Z020-1CLG484CES

## Sheet ZYNQ_PL_Bank_13.SchDoc
size A4; DocumentNumber: 4; SheetNumber: 4; SheetTotal: 47
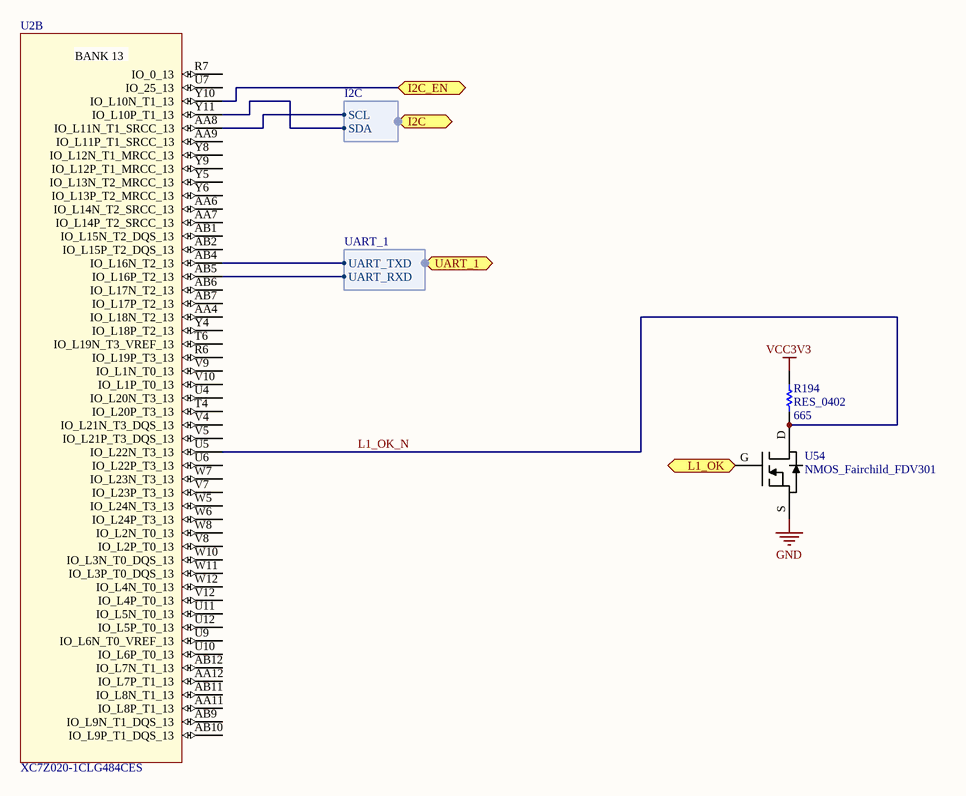
[diagram p5: ZYNQ_PL_Bank_13.SchDoc]

### Parts
R194  RES_0402  value 665  [RESC0402(1005)_N]
U2  XC7Z020-1CLG484CES  [ZYNQ_xc7z020clg484pkg_BGA-484]  (part B of 10)
U54  NMOS_Fairchild_FDV301  [NMOS_Fairchild_FDV301_SOT23-3]

### Ports
I2C (harness I2C), I2C_EN, L1_OK, UART_1 (harness UART_1)

### Harnesses
UART_1: UART_TXD, UART_RXD
I2C: SCL, SDA

### Nets
GND: U54.S
VCC3V3: R194.2
I2C_EN: U2.Y10(IO_L10N_T1_13) ; port I2C_EN
L1_OK_N: R194.1 U2.U5(IO_L22N_T3_13) U54.D
UART_1_RXD: U2.AB5(IO_L16P_T2_13) ; port UART_1.UART_RXD
UART_1_TXD: U2.AB4(IO_L16N_T2_13) ; port UART_1.UART_TXD
NetJ10_5: U2.Y11(IO_L10P_T1_13) ; port I2C.SDA
NetJ10_6: U2.AA8(IO_L11N_T1_SRCC_13) ; port I2C.SCL
NetJ11_2: U54.G ; port L1_OK

Not connected (* = marked no-connect by the designer): U2 AA4(IO_L18N_T2_13) AA6(IO_L14N_T2_SRCC_13) AA7(IO_L14P_T2_SRCC_13) AA9(IO_L11P_T1_SRCC_13) AA11(IO_L8P_T1_13) AA12(IO_L7P_T1_13) AB1(IO_L15N_T2_DQS_13) AB2(IO_L15P_T2_DQS_13) AB6(IO_L17N_T2_13) AB7(IO_L17P_T2_13) AB9(IO_L9N_T1_DQS_13) AB10(IO_L9P_T1_DQS_13) AB11(IO_L8N_T1_13) AB12(IO_L7N_T1_13) R6(IO_L19P_T3_13) R7(IO_0_13) T4(IO_L20P_T3_13) T6(IO_L19N_T3_VREF_13) U4(IO_L20N_T3_13) U6(IO_L22P_T3_13) U7(IO_25_13) U9(IO_L6N_T0_VREF_13) U10(IO_L6P_T0_13) U11(IO_L5N_T0_13) U12(IO_L5P_T0_13) V4(IO_L21N_T3_DQS_13) V5(IO_L21P_T3_DQS_13) V7(IO_L23P_T3_13) V8(IO_L2P_T0_13) V9(IO_L1N_T0_13) V10(IO_L1P_T0_13) V12(IO_L4P_T0_13) W5(IO_L24N_T3_13) W6(IO_L24P_T3_13) W7(IO_L23N_T3_13) W8(IO_L2N_T0_13) W10(IO_L3N_T0_DQS_13) W11(IO_L3P_T0_DQS_13) W12(IO_L4N_T0_13) Y4(IO_L18P_T2_13) Y5(IO_L13N_T2_MRCC_13) Y6(IO_L13P_T2_MRCC_13) Y8(IO_L12N_T1_MRCC_13) Y9(IO_L12P_T1_MRCC_13)

### Notes on the sheet
- (in symbol XC7Z020-1CLG484CES, part B) BANK 13

### Library data of the parts
R194 = ERJ-2RKF6650X: RES 665 OHM 1/10W 1% 0402 SMD; Manufacturer: Panasonic Electronic Components; Tolerance: *; Part Number: ERJ-2RKF6650X; Footprint Ref: RESC0402(1005)_N; Library Ref: RES_0402
U2 = XC7Z020-1CLG484CES: as U2 on sheet ZYNQ_DDR3_Bank_502; Part Number: XC7Z020-1CLG484CES
U54 = FDV301N: MOSFET N-CH 25V 220MA SOT-23; Manufacturer: Fairchild Semiconductor; Part Number: FDV301N; Footprint Ref: NMOS_Fairchild_FDV301_SOT23-3; Library Ref: NMOS_Fairchild_FDV301

## Sheet ZYNQ_PL_Bank_33.SchDoc
size A4; DocumentNumber: 5; SheetNumber: 5; SheetTotal: 47
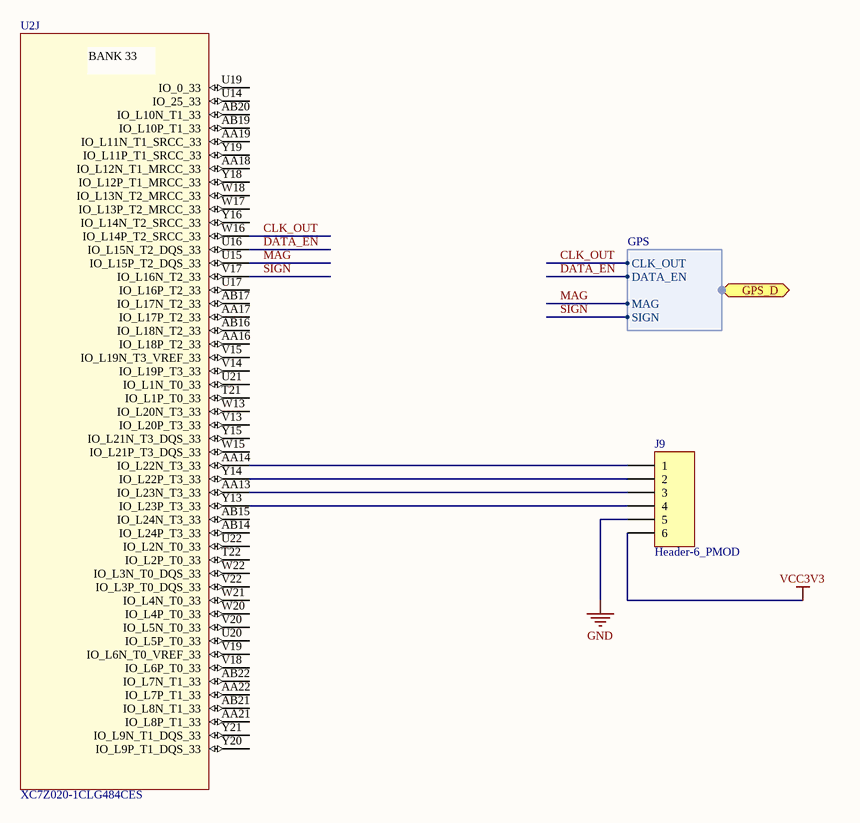
[diagram p6: ZYNQ_PL_Bank_33.SchDoc]

### Parts
J9  Header-6_PMOD  [ConnectorGPIO_Sullins_PPTC061LGBN-RC_6-pos]
U2  XC7Z020-1CLG484CES  [ZYNQ_xc7z020clg484pkg_BGA-484]  (part J of 10)

### Ports
GPS_D (harness GPS)

### Harnesses
GPS: CLK_OUT, DATA_EN, MAG, SIGN

### Nets
GND: J9.5
VCC3V3: J9.6
CLK_OUT: U2.W16(IO_L14P_T2_SRCC_33) ; port GPS_D.CLK_OUT
DATA_EN: U2.U16(IO_L15N_T2_DQS_33) ; port GPS_D.DATA_EN
MAG: U2.U15(IO_L15P_T2_DQS_33) ; port GPS_D.MAG
SIGN: U2.V17(IO_L16N_T2_33) ; port GPS_D.SIGN
NetJ9_1: J9.1 U2.AA14(IO_L22N_T3_33)
NetJ9_2: J9.2 U2.Y14(IO_L22P_T3_33)
NetJ9_3: J9.3 U2.AA13(IO_L23N_T3_33)
NetJ9_4: J9.4 U2.Y13(IO_L23P_T3_33)

Not connected (* = marked no-connect by the designer): U2 AA16(IO_L18P_T2_33) AA17(IO_L17P_T2_33) AA18(IO_L12N_T1_MRCC_33) AA19(IO_L11N_T1_SRCC_33) AA21(IO_L8P_T1_33) AA22(IO_L7P_T1_33) AB14(IO_L24P_T3_33) AB15(IO_L24N_T3_33) AB16(IO_L18N_T2_33) AB17(IO_L17N_T2_33) AB19(IO_L10P_T1_33) AB20(IO_L10N_T1_33) AB21(IO_L8N_T1_33) AB22(IO_L7N_T1_33) T21(IO_L1P_T0_33) T22(IO_L2P_T0_33) U14(IO_25_33) U17(IO_L16P_T2_33) U19(IO_0_33) U20(IO_L5P_T0_33) U21(IO_L1N_T0_33) U22(IO_L2N_T0_33) V13(IO_L20P_T3_33) V14(IO_L19P_T3_33) V15(IO_L19N_T3_VREF_33) V18(IO_L6P_T0_33) V19(IO_L6N_T0_VREF_33) V20(IO_L5N_T0_33) V22(IO_L3P_T0_DQS_33) W13(IO_L20N_T3_33) W15(IO_L21P_T3_DQS_33) W17(IO_L13P_T2_MRCC_33) W18(IO_L13N_T2_MRCC_33) W20(IO_L4P_T0_33) W21(IO_L4N_T0_33) W22(IO_L3N_T0_DQS_33) Y15(IO_L21N_T3_DQS_33) Y16(IO_L14N_T2_SRCC_33) Y18(IO_L12P_T1_MRCC_33) Y19(IO_L11P_T1_SRCC_33) Y20(IO_L9P_T1_DQS_33) Y21(IO_L9N_T1_DQS_33)

### Notes on the sheet
- (in symbol XC7Z020-1CLG484CES, part J) BANK 33

### Library data of the parts
J9 = PPTC061LGBN-RC: CONN FEMALE 6POS .100" R/A TIN; Manufacturer: Sullins Connector Solutions; Part Number: PPTC061LGBN-RC
U2 = XC7Z020-1CLG484CES: as U2 on sheet ZYNQ_DDR3_Bank_502; Part Number: XC7Z020-1CLG484CES

## Sheet ZYNQ_PL_Bank_34.SchDoc
size A4; DocumentNumber: 6; SheetNumber: 6; SheetTotal: 47
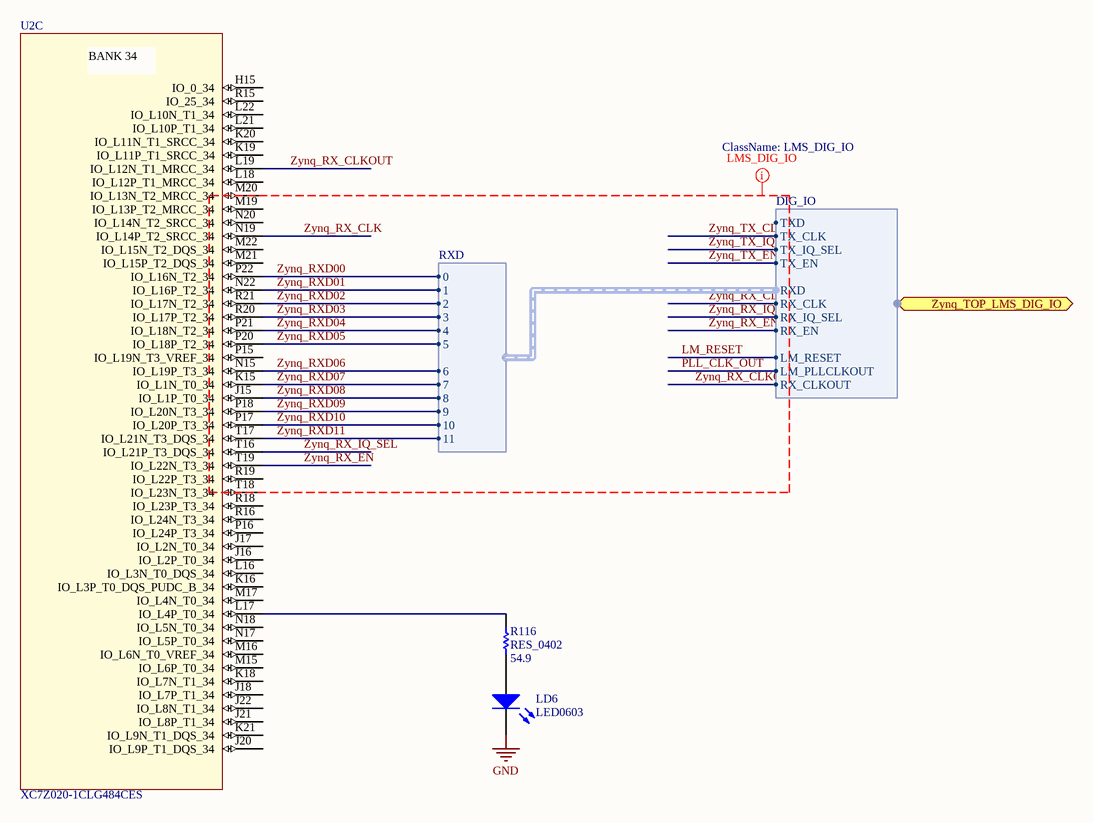
[diagram p7: ZYNQ_PL_Bank_34.SchDoc]

### Parts
LD6  LED0603  [LED0603(1608)_HSMG-C190]
R116  RES_0402  value 54.9  [RESC0402(1005)_N]
U2  XC7Z020-1CLG484CES  [ZYNQ_xc7z020clg484pkg_BGA-484]  (part C of 10)

### Ports
Zynq_TOP_LMS_DIG_IO (harness DIG_IO)

### Harnesses
DIG_IO: TXD, TX_CLK, TX_IQ_SEL, TX_EN, RXD, RX_CLK, RX_IQ_SEL, RX_EN, LM_RESET, LM_PLLCLKOUT, RX_CLKOUT
RXD: 0, 1, 2, 3, 4, 5, 6, 7, 8, 9, 10, 11

### Nets
GND: LD6.1(K)
Zynq_RX_CLK: U2.N19(IO_L14P_T2_SRCC_34) ; port Zynq_TOP_LMS_DIG_IO.RX_CLK  [project net RX_CLK]
Zynq_RX_CLKOUT: U2.L19(IO_L12N_T1_MRCC_34) ; port Zynq_TOP_LMS_DIG_IO.RX_CLKOUT  [project net RX_CLKOUT]
Zynq_RX_EN: U2.T19(IO_L22N_T3_34) ; port Zynq_TOP_LMS_DIG_IO.RX_EN  [project net RX_EN]
Zynq_RX_IQ_SEL: U2.T16(IO_L21P_T3_DQS_34) ; port Zynq_TOP_LMS_DIG_IO.RX_IQ_SEL  [project net RX_IQ_SEL]
Zynq_RXD00: U2.P22(IO_L16N_T2_34) ; harness RXD.0  [project net RXD.0]
Zynq_RXD01: U2.N22(IO_L16P_T2_34) ; harness RXD.1  [project net RXD.1]
Zynq_RXD02: U2.R21(IO_L17N_T2_34) ; harness RXD.2  [project net RXD.2]
Zynq_RXD03: U2.R20(IO_L17P_T2_34) ; harness RXD.3  [project net RXD.3]
Zynq_RXD04: U2.P21(IO_L18N_T2_34) ; harness RXD.4  [project net RXD.4]
Zynq_RXD05: U2.P20(IO_L18P_T2_34) ; harness RXD.5  [project net RXD.5]
Zynq_RXD06: U2.N15(IO_L19P_T3_34) ; harness RXD.6  [project net RXD.6]
Zynq_RXD07: U2.K15(IO_L1N_T0_34) ; harness RXD.7  [project net RXD.7]
Zynq_RXD08: U2.J15(IO_L1P_T0_34) ; harness RXD.8  [project net RXD.8]
Zynq_RXD09: U2.P18(IO_L20N_T3_34) ; harness RXD.9  [project net RXD.9]
Zynq_RXD10: U2.P17(IO_L20P_T3_34) ; harness RXD.10  [project net RXD.10]
Zynq_RXD11: U2.T17(IO_L21N_T3_DQS_34) ; harness RXD.11  [project net RXD.11]
NetLD6_2: LD6.2(A) R116.1
NetR116_2: R116.2 U2.L17(IO_L4P_T0_34)

Not connected (* = marked no-connect by the designer): U2 H15(IO_0_34) J16(IO_L2P_T0_34) J17(IO_L2N_T0_34) J18(IO_L7P_T1_34) J20(IO_L9P_T1_DQS_34) J21(IO_L8P_T1_34) J22(IO_L8N_T1_34) K16(IO_L3P_T0_DQS_PUDC_B_34) K18(IO_L7N_T1_34) K19(IO_L11P_T1_SRCC_34) K20(IO_L11N_T1_SRCC_34) K21(IO_L9N_T1_DQS_34) L16(IO_L3N_T0_DQS_34) L18(IO_L12P_T1_MRCC_34) L21(IO_L10P_T1_34) L22(IO_L10N_T1_34) M15(IO_L6P_T0_34) M16(IO_L6N_T0_VREF_34) M17(IO_L4N_T0_34) M19(IO_L13P_T2_MRCC_34) M20(IO_L13N_T2_MRCC_34) M21(IO_L15P_T2_DQS_34) M22(IO_L15N_T2_DQS_34) N17(IO_L5P_T0_34) N18(IO_L5N_T0_34) N20(IO_L14N_T2_SRCC_34) P15(IO_L19N_T3_VREF_34) P16(IO_L24P_T3_34) R15(IO_25_34) R16(IO_L24N_T3_34) R18(IO_L23P_T3_34) R19(IO_L22P_T3_34) T18(IO_L23N_T3_34)

### Layout directives
net class LMS_DIG_IO: LM_RESET, PLL_CLK_OUT, Zynq_RX_CLK, Zynq_RX_CLKOUT, Zynq_RX_EN, Zynq_RX_IQ_SEL, Zynq_RXD00, Zynq_RXD01, Zynq_RXD02, Zynq_RXD03, Zynq_RXD04, Zynq_RXD05, Zynq_RXD06, Zynq_RXD07, Zynq_RXD08, Zynq_RXD09, Zynq_RXD10, Zynq_RXD11, Zynq_TX_CLK, Zynq_TX_EN, Zynq_TX_IQ_SEL

### Notes on the sheet
- (in symbol XC7Z020-1CLG484CES, part C) BANK 34

### Library data of the parts
LD6 = "HSMG-C190": as LD2 on sheet ZYNQ_MIOBank_500; Part Number: "HSMG-C190"; Footprint Ref: LED0603(1608); Library Ref: LED0603
R116 = ERJ-2RKF54R9X: as R113 on sheet ZYNQ_MIOBank_500; Tolerance: *; Part Number: ERJ-2RKF54R9X; Footprint Ref: RESC0402(1005)_N; Library Ref: RES_0402
U2 = XC7Z020-1CLG484CES: as U2 on sheet ZYNQ_DDR3_Bank_502; Part Number: XC7Z020-1CLG484CES

## Sheet ZYNQ_PL_Bank_35.SchDoc
size A4; DocumentNumber: 7; SheetNumber: 7; SheetTotal: 47
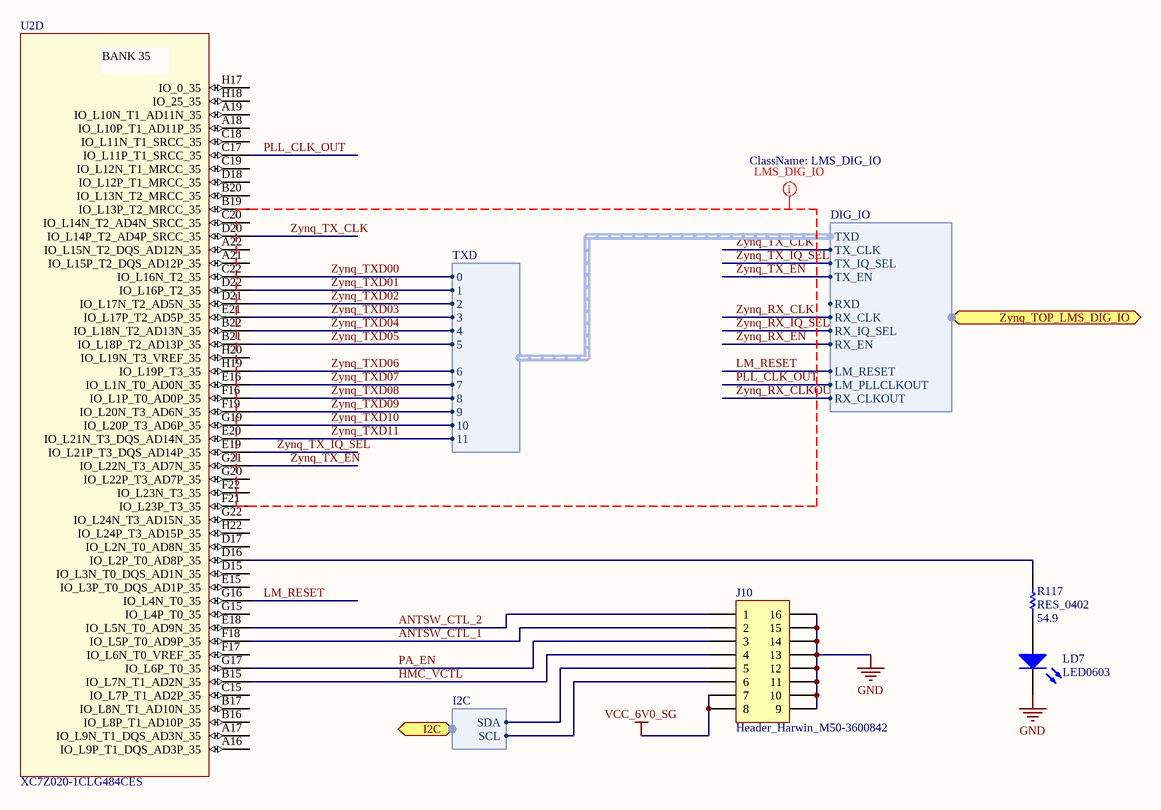
[diagram p8: ZYNQ_PL_Bank_35.SchDoc]

### Parts
J10  Header_Harwin_M50-3600842  [Header_Harwin_M50-3600842_16-pos]
LD7  LED0603  [LED0603(1608)_HSMG-C190]
R117  RES_0402  value 54.9  [RESC0402(1005)_N]
U2  XC7Z020-1CLG484CES  [ZYNQ_xc7z020clg484pkg_BGA-484]  (part D of 10)

### Ports
I2C (harness I2C), Zynq_TOP_LMS_DIG_IO (harness DIG_IO)

### Harnesses
TXD: 0, 1, 2, 3, 4, 5, 6, 7, 8, 9, 10, 11
DIG_IO: TXD, TX_CLK, TX_IQ_SEL, TX_EN, RXD, RX_CLK, RX_IQ_SEL, RX_EN, LM_RESET, LM_PLLCLKOUT, RX_CLKOUT
I2C: SCL, SDA

### Nets
GND: J10.9 J10.10 J10.11 J10.12 J10.13 J10.14 J10.15 J10.16 LD7.1(K)
VCC_6V0_SG: J10.7 J10.8
ANTSW_CTL_1: J10.2 U2.F18(IO_L5P_T0_AD9P_35)
ANTSW_CTL_2: J10.1 U2.E18(IO_L5N_T0_AD9N_35)
HMC_VCTL: J10.4 U2.B15(IO_L7N_T1_AD2N_35)
LM_RESET: U2.G16(IO_L4N_T0_35) ; port Zynq_TOP_LMS_DIG_IO.LM_RESET
PA_EN: J10.3 U2.G17(IO_L6P_T0_35)
PLL_CLK_OUT: U2.C17(IO_L11P_T1_SRCC_35) ; port Zynq_TOP_LMS_DIG_IO.LM_PLLCLKOUT
Zynq_TX_CLK: U2.D20(IO_L14P_T2_AD4P_SRCC_35) ; port Zynq_TOP_LMS_DIG_IO.TX_CLK  [project net TX_CLK]
Zynq_TX_EN: U2.G21(IO_L22N_T3_AD7N_35) ; port Zynq_TOP_LMS_DIG_IO.TX_EN  [project net TX_EN]
Zynq_TX_IQ_SEL: U2.E19(IO_L21P_T3_DQS_AD14P_35) ; port Zynq_TOP_LMS_DIG_IO.TX_IQ_SEL  [project net TX_IQ_SEL]
Zynq_TXD00: U2.C22(IO_L16N_T2_35) ; harness TXD.0  [project net TXD00]
Zynq_TXD01: U2.D22(IO_L16P_T2_35) ; harness TXD.1  [project net TXD01]
Zynq_TXD02: U2.D21(IO_L17N_T2_AD5N_35) ; harness TXD.2  [project net TXD02]
Zynq_TXD03: U2.E21(IO_L17P_T2_AD5P_35) ; harness TXD.3  [project net TXD03]
Zynq_TXD04: U2.B22(IO_L18N_T2_AD13N_35) ; harness TXD.4  [project net TXD04]
Zynq_TXD05: U2.B21(IO_L18P_T2_AD13P_35) ; harness TXD.5  [project net TXD05]
Zynq_TXD06: U2.H19(IO_L19P_T3_35) ; harness TXD.6  [project net TXD06]
Zynq_TXD07: U2.E16(IO_L1N_T0_AD0N_35) ; harness TXD.7  [project net TXD07]
Zynq_TXD08: U2.F16(IO_L1P_T0_AD0P_35) ; harness TXD.8  [project net TXD08]
Zynq_TXD09: U2.F19(IO_L20N_T3_AD6N_35) ; harness TXD.9  [project net TXD09]
Zynq_TXD10: U2.G19(IO_L20P_T3_AD6P_35) ; harness TXD.10  [project net TXD10]
Zynq_TXD11: U2.E20(IO_L21N_T3_DQS_AD14N_35) ; harness TXD.11  [project net TXD11]
NetJ10_5: J10.5 ; port I2C.SDA
NetJ10_6: J10.6 ; port I2C.SCL
NetLD7_2: LD7.2(A) R117.1
NetR117_2: R117.2 U2.D16(IO_L2P_T0_AD8P_35)

Not connected (* = marked no-connect by the designer): U2 A16(IO_L9P_T1_DQS_AD3P_35) A17(IO_L9N_T1_DQS_AD3N_35) A18(IO_L10P_T1_AD11P_35) A19(IO_L10N_T1_AD11N_35) A21(IO_L15P_T2_DQS_AD12P_35) A22(IO_L15N_T2_DQS_AD12N_35) B16(IO_L8P_T1_AD10P_35) B17(IO_L8N_T1_AD10N_35) B19(IO_L13P_T2_MRCC_35) B20(IO_L13N_T2_MRCC_35) C15(IO_L7P_T1_AD2P_35) C18(IO_L11N_T1_SRCC_35) C19(IO_L12N_T1_MRCC_35) C20(IO_L14N_T2_AD4N_SRCC_35) D15(IO_L3N_T0_DQS_AD1N_35) D17(IO_L2N_T0_AD8N_35) D18(IO_L12P_T1_MRCC_35) E15(IO_L3P_T0_DQS_AD1P_35) F17(IO_L6N_T0_VREF_35) F21(IO_L23P_T3_35) F22(IO_L23N_T3_35) G15(IO_L4P_T0_35) G20(IO_L22P_T3_AD7P_35) G22(IO_L24N_T3_AD15N_35) H17(IO_0_35) H18(IO_25_35) H20(IO_L19N_T3_VREF_35) H22(IO_L24P_T3_AD15P_35)

### Layout directives
net class LMS_DIG_IO: LM_RESET, PLL_CLK_OUT, Zynq_RX_CLK, Zynq_RX_CLKOUT, Zynq_RX_EN, Zynq_RX_IQ_SEL, Zynq_TX_CLK, Zynq_TX_EN, Zynq_TX_IQ_SEL, Zynq_TXD00, Zynq_TXD01, Zynq_TXD02, Zynq_TXD03, Zynq_TXD04, Zynq_TXD05, Zynq_TXD06, Zynq_TXD07, Zynq_TXD08, Zynq_TXD09, Zynq_TXD10, Zynq_TXD11

### Notes on the sheet
- (in symbol XC7Z020-1CLG484CES, part D) BANK 35

### Library data of the parts
J10 = M50-3600842: CONN HDR 1.27MM SMD AU 16POS; Manufacturer: Harwin Inc; Part Number: M50-3600842
LD7 = "HSMG-C190": as LD2 on sheet ZYNQ_MIOBank_500; Part Number: "HSMG-C190"; Footprint Ref: LED0603(1608); Library Ref: LED0603
R117 = ERJ-2RKF54R9X: as R113 on sheet ZYNQ_MIOBank_500; Tolerance: *; Part Number: ERJ-2RKF54R9X; Footprint Ref: RESC0402(1005)_N; Library Ref: RES_0402
U2 = XC7Z020-1CLG484CES: as U2 on sheet ZYNQ_DDR3_Bank_502; Part Number: XC7Z020-1CLG484CES